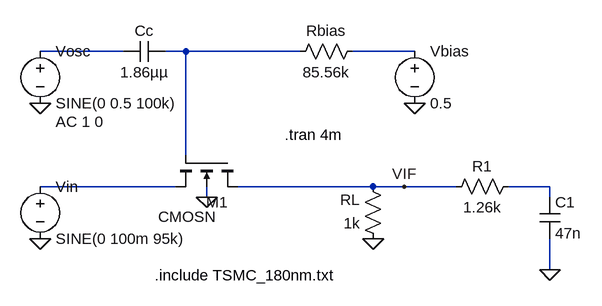
[diagram p0: schematic mixer+lowpass.asc]
mixer+lowpass.asc, the LTspice schematic file:
Version 4
SHEET 1 936 680
WIRE 224 160 96 160
WIRE 320 160 288 160
WIRE 496 160 320 160
WIRE 672 160 576 160
WIRE 320 320 320 160
WIRE 304 368 96 368
WIRE 608 368 400 368
WIRE 656 368 608 368
WIRE 736 368 656 368
WIRE 880 368 816 368
WIRE 352 384 352 368
WIRE 880 384 880 368
WIRE 880 496 880 448
FLAG 672 240 0
FLAG 96 240 0
FLAG 96 448 0
FLAG 608 448 0
FLAG 352 384 0
FLAG 656 368 VIF
FLAG 880 496 0
SYMBOL nmos4 400 320 R90
WINDOW 0 72 15 VRight 2
WINDOW 3 94 33 VRight 2
SYMATTR InstName M1
SYMATTR Value CMOSN
SYMATTR Value2 l=1u w=3u ad=7.5uu as=7.5uu pd=11u ps=11u
SYMBOL voltage 96 144 R0
WINDOW 123 24 124 Left 2
WINDOW 39 0 0 Left 0
SYMATTR Value2 AC 1 0
SYMATTR InstName Vosc
SYMATTR Value SINE(0 0.5 100k)
SYMBOL voltage 96 352 R0
SYMATTR InstName Vin
SYMATTR Value SINE(0 100m 95k)
SYMBOL voltage 672 144 R0
SYMATTR InstName Vbias
SYMATTR Value 0.5
SYMBOL cap 288 144 R90
WINDOW 0 0 32 VBottom 2
WINDOW 3 32 32 VTop 2
SYMATTR InstName Cc
SYMATTR Value 1.86µµ
SYMBOL res 592 144 R90
WINDOW 0 0 56 VBottom 2
WINDOW 3 32 56 VTop 2
SYMATTR InstName Rbias
SYMATTR Value 85.56k
SYMBOL res 624 464 R180
WINDOW 0 36 76 Left 2
WINDOW 3 36 40 Left 2
SYMATTR InstName RL
SYMATTR Value 1k
SYMBOL res 832 352 R90
WINDOW 0 0 56 VBottom 2
WINDOW 3 32 56 VTop 2
SYMATTR InstName R1
SYMATTR Value 1.26k
SYMBOL cap 864 384 R0
SYMATTR InstName C1
SYMATTR Value 47n
TEXT 272 504 Left 2 !.include TSMC_180nm.txt
TEXT 472 288 Left 2 !.tran 4m

The netlist it stands for:
* mixer+lowpass.asc
M1 VIF N002 N004 0 CMOSN l=1u w=3u ad=7.5uu as=7.5uu pd=11u ps=11u
Vosc N001 0 SINE(0 0.5 100k) AC 1 0
Vin N004 0 SINE(0 100m 95k)
Vbias N003 0 0.5
Cc N002 N001 1.86µµ
Rbias N003 N002 85.56k
RL 0 VIF 1k
R1 N005 VIF 1.26k
C1 N005 0 47n
.model NMOS NMOS
.model PMOS PMOS
.lib standard.mos
.include TSMC_180nm.txt
.tran 4m
.backanno
.end